# EAGLE schematic ShiftSlice (EAGLE 6.5.0)
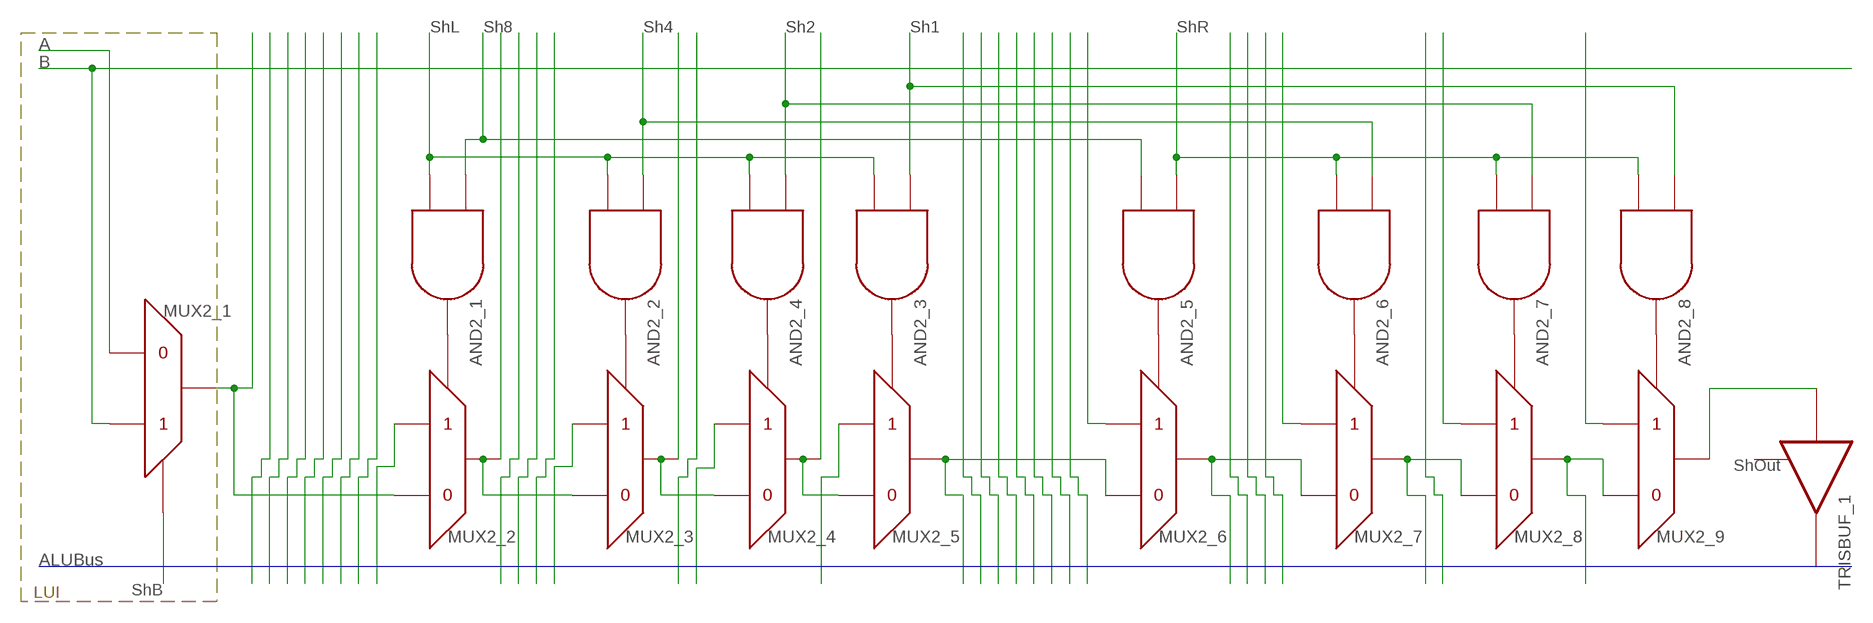
[diagram p0: schematic, sheet 1]

## Parts
AND2_1  AND2  [3PIN]
AND2_2  AND2  [3PIN]
AND2_3  AND2  [3PIN]
AND2_4  AND2  [3PIN]
AND2_5  AND2  [3PIN]
AND2_6  AND2  [3PIN]
AND2_7  AND2  [3PIN]
AND2_8  AND2  [3PIN]
MUX2_1  MUX2  [5PIN]
MUX2_2  MUX2  [5PIN]
MUX2_3  MUX2  [5PIN]
MUX2_4  MUX2  [5PIN]
MUX2_5  MUX2  [5PIN]
MUX2_6  MUX2  [5PIN]
MUX2_7  MUX2  [5PIN]
MUX2_8  MUX2  [5PIN]
MUX2_9  MUX2  [5PIN]
TRISBUF_1  TRISBUF  [3PIN]

## Nets
N$1: AND2_1.P$2(I1) AND2_2.P$2(I1) AND2_3.P$2(I1) AND2_4.P$2(I1)
N$2: AND2_5.P$1(A) AND2_6.P$2(I1) AND2_7.P$2(I1) AND2_8.P$2(I1)
N$3: MUX2_2.P$3
N$4: MUX2_3.P$3
N$5: MUX2_4.P$3
N$6: MUX2_6.P$3 MUX2_7.P$1
N$8: MUX2_7.P$3 MUX2_8.P$1
N$9: MUX2_8.P$3 MUX2_9.P$1
N$10: MUX2_2.P$2
N$18: MUX2_1.P$3 MUX2_2.P$1
N$23: MUX2_3.P$2
N$24: MUX2_4.P$2
N$25: MUX2_5.P$2
N$27: MUX2_6.P$2
N$37: MUX2_7.P$2
N$39: MUX2_8.P$2
N$40: MUX2_9.P$2
N$41: AND2_1.P$1(A) AND2_5.P$2(I1)
N$42: AND2_2.P$1(A) AND2_6.P$1(A)
N$43: AND2_4.P$1(A) AND2_7.P$1(A)
N$44: AND2_3.P$1(A) AND2_8.P$1(A)
N$45: MUX2_1.P$4
N$46: MUX2_4.P$1
N$47: MUX2_9.P$3 TRISBUF_1.P$1(I)
N$49: MUX2_1.P$1
N$50: MUX2_1.P$2
N$52: AND2_1.P$3(O) MUX2_2.P$4
N$53: AND2_2.P$3(O) MUX2_3.P$4
N$54: AND2_4.P$3(O) MUX2_4.P$4
N$55: AND2_3.P$3(O) MUX2_5.P$4
N$56: AND2_5.P$3(O) MUX2_6.P$4
N$57: AND2_6.P$3(O) MUX2_7.P$4
N$58: AND2_7.P$3(O) MUX2_8.P$4
N$59: AND2_8.P$3(O) MUX2_9.P$4
N$61: MUX2_5.P$1
N$62: MUX2_3.P$1
N$63: MUX2_5.P$3 MUX2_6.P$1
Unconnected: TRISBUF_1.P$2(O) TRISBUF_1.P$3

## Buses
B$1

## Notes on the sheet
- ShL | Sh8 | Sh4 | Sh2 | Sh1 | ShR
- A
- B
- ShOut
- ALUBus
- ShB
- LUI

## Library data of the parts
AND2_1-AND2_8 = c035u:AND2
MUX2_1-MUX2_9 = c035u:MUX2
TRISBUF_1 = c035u:TRISBUF